# EAGLE design hpma115c0-004_adapter (EAGLE 9.6.2)
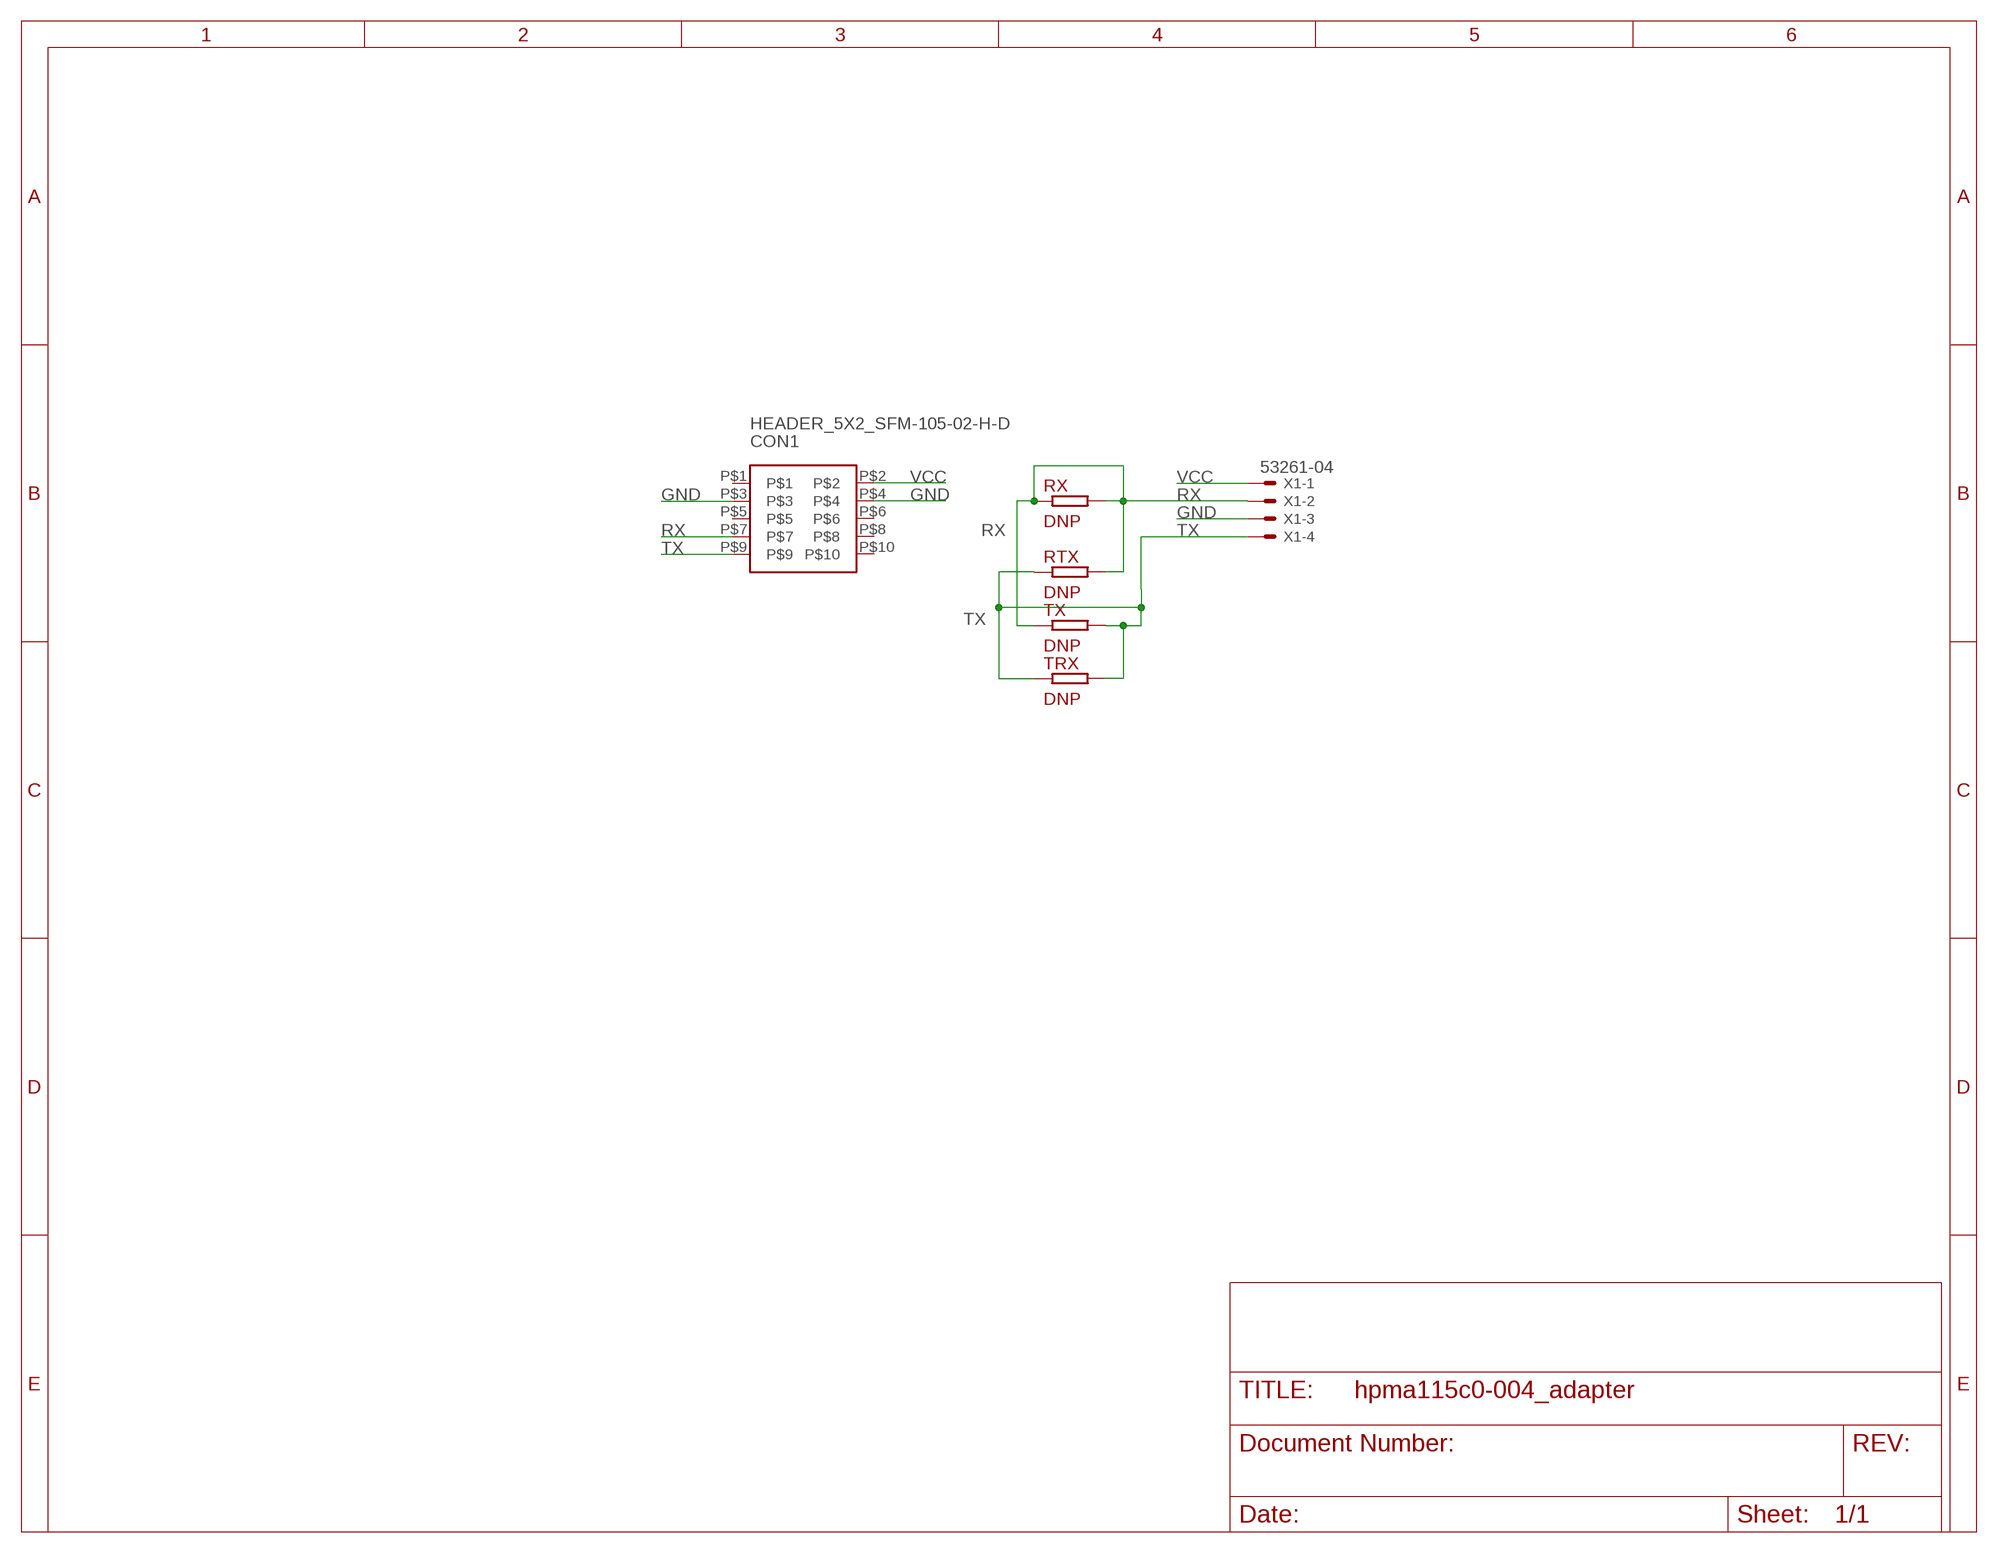
[diagram p0: schematic, sheet 1]

## Parts
CON1  HEADER_5X2_SFM-105-02-H-D  [HEADER_5X2_1.27X1.27_SMD_SAMTEK]
RTX  DNP  RESISTOR_0402  [SMD_0402]
RX  DNP  RESISTOR_0402  [SMD_0402]
TRX  DNP  RESISTOR_0402  [SMD_0402]
TX  DNP  RESISTOR_0402  [SMD_0402]
X1  53261-04  [53261-04]

## Nets
GND: CON1.P$3 CON1.P$4 X1.3
RX: CON1.P$7 RTX.P$2 RX.P$1 RX.P$2 TX.P$1 X1.2
TX: CON1.P$9 RTX.P$1 TRX.P$1 TRX.P$2 TX.P$2 X1.4
VCC: CON1.P$2 X1.1
Unconnected: CON1.P$1 CON1.P$5 CON1.P$6 CON1.P$8 CON1.P$10

## Library data of the parts
CON1 = daneagle_db8.0:HEADER_5X2
RTX RX TRX TX = daneagle_db8.0:RESISTOR
X1 = con-molex:53?-04: CONNECTOR wire to board 1.25 mm (.049 inch) pitch header; MF: MOLEX; OC_FARNELL: 1125374; OC_NEWARK: unknown

## Board
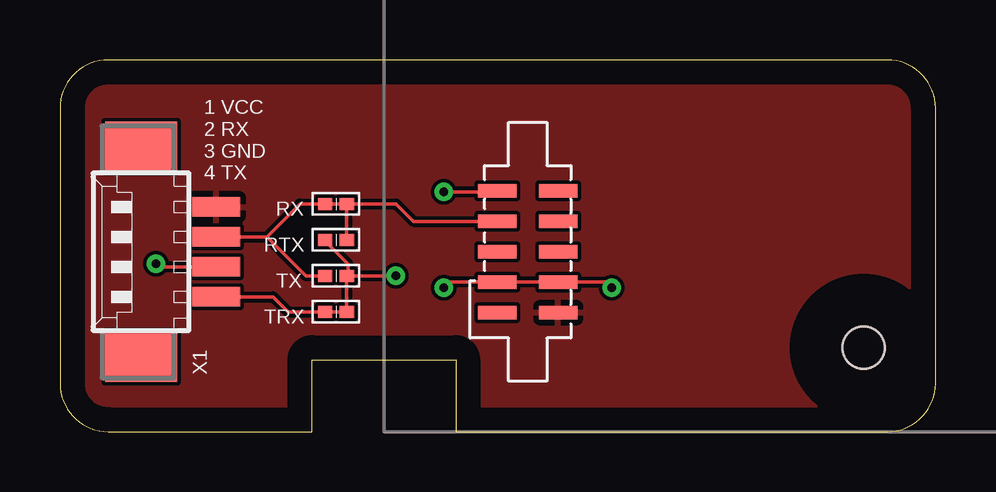
[diagram p1: board, top side]
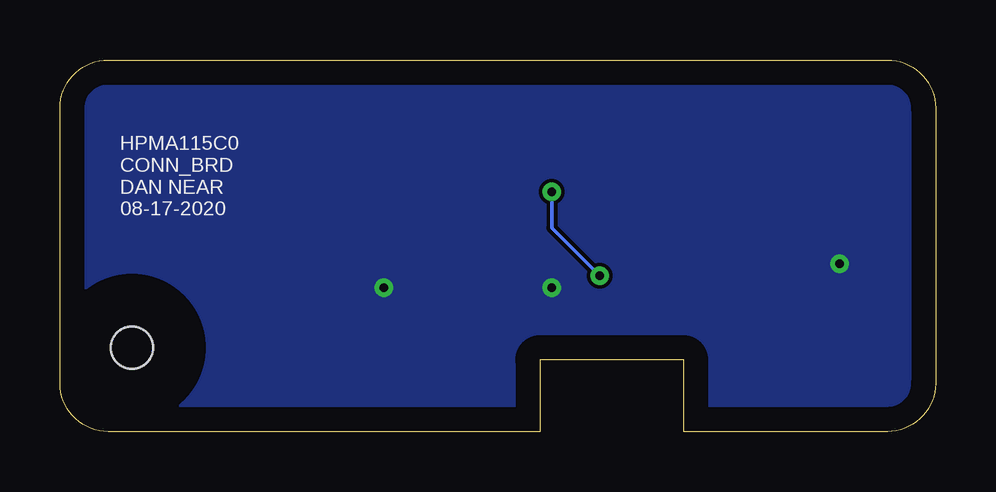
[diagram p2: board, bottom side, seen from below]

Size 36.5 x 15.5 mm. Coordinates in mm from the lower left corner, seen from the top.
Outline: 0,13.5 0,2 arc90 2,0 10.5,0 10.5,3 16.5,3 16.5,0 34.5,0 arc90 36.5,2 36.5,13.5 arc90 34.5,15.5 2,15.5 arc90 0,13.5
Copper layers (1*16): Top 0.035mm / dielectric 1.5mm / Bottom 0.035mm
Design rules "default": minimum track width 6mil, minimum drill 0.35mm, track to track 6mil, track to pad 6mil, pad to pad 6mil, via to via 6mil, smd to smd 6mil, copper to edge 40mil, drill to drill 6mil, minimum pad ring 10mil, minimum via ring 8mil, stop-mask expansion 4mil, vias tented up to drill 0mil, thermal gap 10mil
Holes 1.75 mm at 33.5,3.5
tRestrict: area 30.5,0.5 to 36.5,6.5
bRestrict: area 30.5,0.5 to 36.5,6.5

### Footprints (pad centres in the part's own frame; a part is rotated, then mirrored left to right if it is on the bottom)
HEADER_5X2_1.27X1.27_SMD_SAMTEK = smd 0.55 x 1.595: P$1 -2.54,1.27; P$2 -2.54,-1.27; P$3 -1.27,1.27; P$4 -1.27,-1.27; P$5 0,1.27; P$6 0,-1.27; P$7 1.27,1.27; P$8 1.27,-1.27; P$9 2.54,1.27; P$10 2.54,-1.27
SMD_0402 = smd 0.6 x 0.5: P$1 -0.45,0; P$2 0.45,0
53261-04 = smd 0.8 x 2: 1 1.875,-2.5; 2 0.625,-2.5; 3 -0.625,-2.5; 4 -1.875,-2.5 | smd 2.1 x 3: S1 4.375,0.625; S2 -4.375,0.625

### Placement (x,y rotation side)
CON1  19.5,7.5 90 top
RTX  11.5,8 0 top
RX  11.5,9.5 0 top
TRX  11.5,5 0 top
TX  11.5,6.5 0 top
X1  4,7.5 90 top

### Tracks (layer width: path | path; a pad name or v marks a point on that pad's centre or on a via)
GND  (via drill 0.35)
  Top 0.152: X1.3 4.12,6.88 v4,7 | v16,6 16.23,6.23 CON1.P$3 CON1.P$4 22.77,6.23 v23,6
  pour Bottom: 0,15.5 36.5,15.5 36.5,0 0,0
RX
  Top 0.152: X1.2 8.62,8.12 | 8.62,8.12 10,9.5 RX.P$1 RX.P$2 | RX.P$2 RTX.P$2 | RX.P$2 14,9.5 14.73,8.77 CON1.P$7 | TX.P$1 10.25,6.5 8.62,8.12
TX  (via drill 0.35)
  Top 0.152: CON1.P$9 18.19,10 v16,10 | v14,6.5 TX.P$2 | TX.P$2 TRX.P$2 TRX.P$1 9.5,5 8.88,5.62 X1.4 | TX.P$2 12,6.55 12,7 11.05,7.95 RTX.P$1
  Bottom 0.152: v16,10 16,8.5 v14,6.5
VCC
  pour Top: 0,0 36.5,0 36.5,15.5 0,15.5

### Text on the board
tPlace: 1 VCC / 2 RX / 3 GND / 4 TX
bPlace: HPMA115C0 / CONN_BRD / DAN NEAR / 08-17-2020
Measures: 4,7.5 | 19.5x7.5 | 0,15.5 | 36.5,15.5 | 33.5,3.5 | 16.5,3 | 10.5,0 | 36.5,0 | 16.5,0